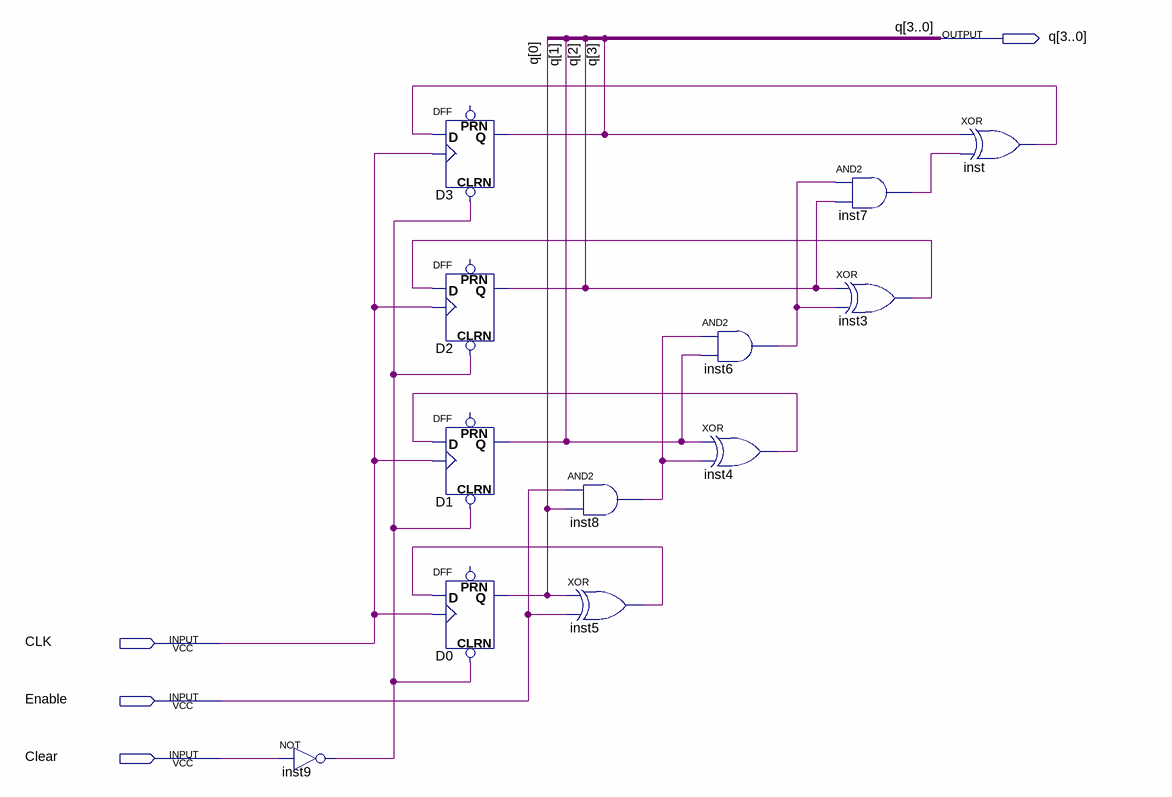
[diagram p0: schematic sheet]
// Quartus schematic Counter_4bit.bdf as structural Verilog: 12 symbols, 4 pins
module Counter_4bit (
  input  CLK,
  input  Enable,
  input  Clear,
  output [3:0] q
);

  wire inst3_out, inst4_out, inst5_out, inst6_out, inst7_out, inst8_out, inst9_out, inst_out;

  not inst9 (inst9_out, Clear);
  DFF D3 (.CLRN(inst9_out), .CLK(CLK), .D(inst_out), .Q(q[3]));  // open: PRN
  DFF D2 (.CLRN(inst9_out), .CLK(CLK), .D(inst3_out), .Q(q[2]));  // open: PRN
  DFF D1 (.CLRN(inst9_out), .CLK(CLK), .D(inst4_out), .Q(q[1]));  // open: PRN
  DFF D0 (.CLRN(inst9_out), .CLK(CLK), .D(inst5_out), .Q(q[0]));  // open: PRN
  and inst8 (inst8_out, Enable, q[0]);
  xor inst5 (inst5_out, q[0], Enable);
  and inst6 (inst6_out, inst8_out, q[1]);
  xor inst4 (inst4_out, q[1], inst8_out);
  and inst7 (inst7_out, inst6_out, q[2]);
  xor inst3 (inst3_out, q[2], inst6_out);
  xor inst (inst_out, q[3], inst7_out);
endmodule
